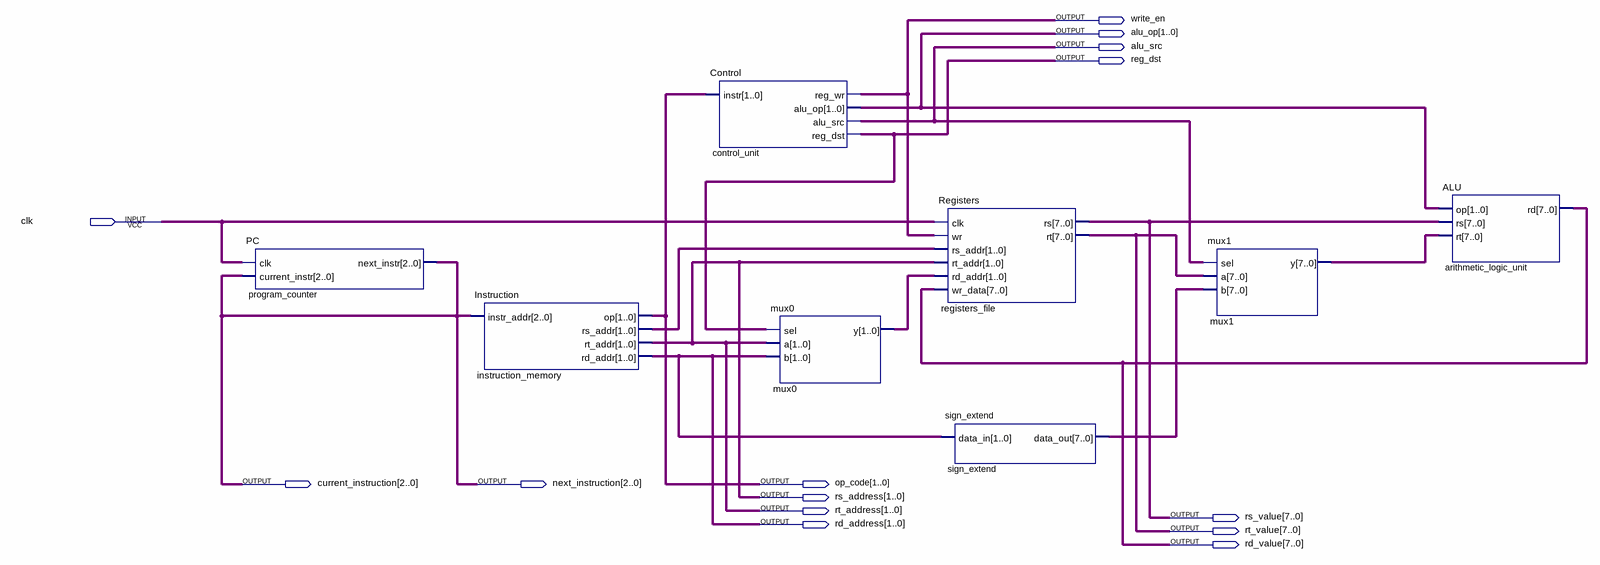
[diagram p0: schematic sheet]
// Quartus schematic Processor.bdf as structural Verilog: 8 symbols, 14 pins
module Processor (
  input  clk,
  output write_en,
  output [1:0] alu_op,
  output alu_src,
  output reg_dst,
  output [2:0] current_instruction,
  output [2:0] next_instruction,
  output [1:0] op_code,
  output [1:0] rs_address,
  output [1:0] rt_address,
  output [7:0] rs_value,
  output [1:0] rd_address,
  output [7:0] rt_value,
  output [7:0] rd_value
);

  wire [1:0] instruction_memory_rs_addr, mux0_y;
  wire [7:0] mux1_y, sign_extend_data_out;

  PC program_counter (.clk(clk), .current_instr(current_instruction), .next_instr(current_instruction));
  Instruction instruction_memory (
    .instr_addr(current_instruction), .op(op_code), .rs_addr(instruction_memory_rs_addr),
    .rt_addr(rs_address), .rd_addr(rd_address));
  Control control_unit (.instr(op_code), .reg_wr(write_en), .alu_op(alu_op), .alu_src(alu_src), .reg_dst(reg_dst));
  mux0 mux0 (.sel(reg_dst), .a(rs_address), .b(rd_address), .y(mux0_y));
  Registers registers_file (
    .clk(clk), .wr(write_en), .rs_addr(instruction_memory_rs_addr), .rt_addr(rs_address), .rd_addr(mux0_y),
    .wr_data(rd_value), .rs(rs_value), .rt(rt_value));
  sign_extend sign_extend (.data_in(rd_address), .data_out(sign_extend_data_out));
  mux1 mux1 (.sel(alu_src), .a(rt_value), .b(sign_extend_data_out), .y(mux1_y));
  ALU arithmetic_logic_unit (.op(alu_op), .rs(rs_value), .rt(mux1_y), .rd(rd_value));

  assign next_instruction = current_instruction;
  assign rt_address = rs_address;
endmodule
